# Altium schematic sheet Bypass_FPGA_3V3.SchDoc: FPGA Bypass 3V3
size A4; Organization: Altium Limited.; Address1: Level 3, 12a Rodborough Rd; Address2: Frenchs Forest 2086; Address3: NSW; Address4: AUSTRALIA; SheetNumber: 7; SheetTotal: 23; PageSetup: Record=PageOptions|CenterHorizontal=True|CenterVertical=True|PrintScale=0.97|XCorrection=1.00|YCorrection=1.00|PrintKind=0|BorderSize=5000000|LeftOffset=0|BottomOffset=0|Orientation=2|PaperLength=1000|PaperWidth=1000|Scale=100|PaperSource=7|PrintQuality=-4|MediaType=1|DitherType=10|PaperKind=A4 (210 x 297 mm)|PrintScaleMode=1
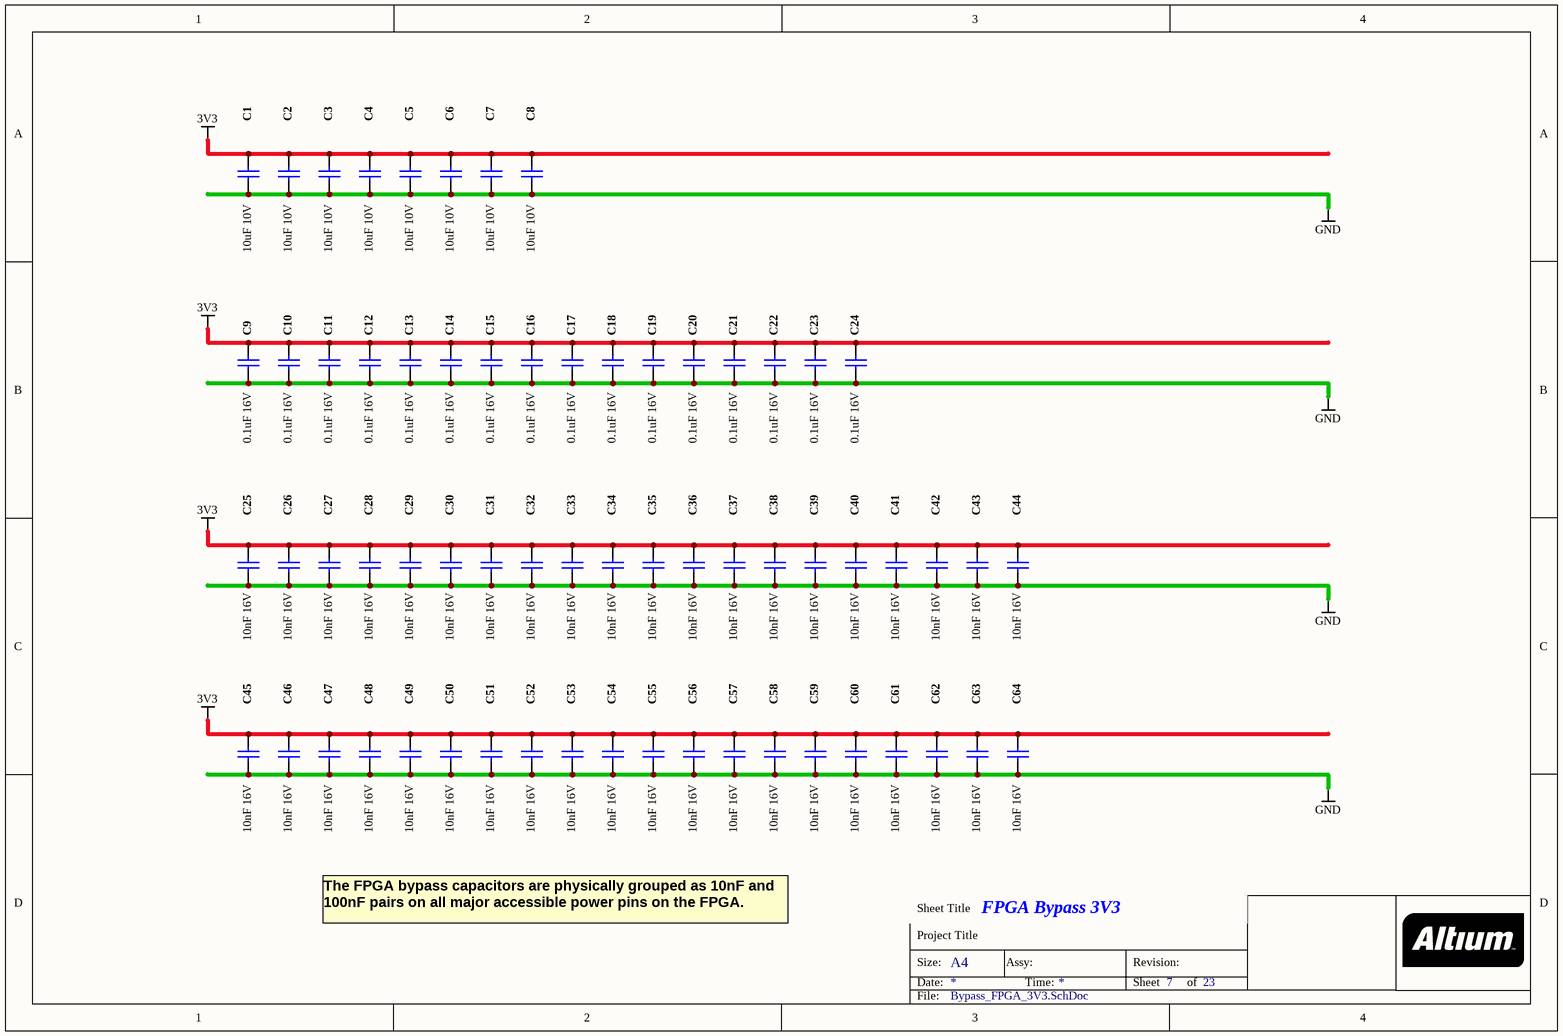
[diagram p0: Bypass_FPGA_3V3.SchDoc]

## Parts
C1  10uF 10V  [CAPC2012-STAR]
C2  10uF 10V  [CAPC2012-STAR]
C3  10uF 10V  [CAPC2012-STAR]
C4  10uF 10V  [CAPC2012-STAR]
C5  10uF 10V  [CAPC2012-STAR]
C6  10uF 10V  [CAPC2012-STAR]
C7  10uF 10V  [CAPC2012-STAR]
C8  10uF 10V  [CAPC2012-STAR]
C9  0.1uF 16V  [CAPC1005-STAR]
C10  0.1uF 16V  [CAPC1005-STAR]
C11  0.1uF 16V  [CAPC1005-STAR]
C12  0.1uF 16V  [CAPC1005-STAR]
C13  0.1uF 16V  [CAPC1005-STAR]
C14  0.1uF 16V  [CAPC1005-STAR]
C15  0.1uF 16V  [CAPC1005-STAR]
C16  0.1uF 16V  [CAPC1005-STAR]
C17  0.1uF 16V  [CAPC1005-STAR]
C18  0.1uF 16V  [CAPC1005-STAR]
C19  0.1uF 16V  [CAPC1005-STAR]
C20  0.1uF 16V  [CAPC1005-STAR]
C21  0.1uF 16V  [CAPC1005-STAR]
C22  0.1uF 16V  [CAPC1005-STAR]
C23  0.1uF 16V  [CAPC1005-STAR]
C24  0.1uF 16V  [CAPC1005-STAR]
C25  10nF 16V  [CAPC1005-STAR]
C26  10nF 16V  [CAPC1005-STAR]
C27  10nF 16V  [CAPC1005-STAR]
C28  10nF 16V  [CAPC1005-STAR]
C29  10nF 16V  [CAPC1005-STAR]
C30  10nF 16V  [CAPC1005-STAR]
C31  10nF 16V  [CAPC1005-STAR]
C32  10nF 16V  [CAPC1005-STAR]
C33  10nF 16V  [CAPC1005-STAR]
C34  10nF 16V  [CAPC1005-STAR]
C35  10nF 16V  [CAPC1005-STAR]
C36  10nF 16V  [CAPC1005-STAR]
C37  10nF 16V  [CAPC1005-STAR]
C38  10nF 16V  [CAPC1005-STAR]
C39  10nF 16V  [CAPC1005-STAR]
C40  10nF 16V  [CAPC1005-STAR]
C41  10nF 16V  [CAPC1005-STAR]
C42  10nF 16V  [CAPC1005-STAR]
C43  10nF 16V  [CAPC1005-STAR]
C44  10nF 16V  [CAPC1005-STAR]
C45  10nF 16V  [CAPC1005-STAR]
C46  10nF 16V  [CAPC1005-STAR]
C47  10nF 16V  [CAPC1005-STAR]
C48  10nF 16V  [CAPC1005-STAR]
C49  10nF 16V  [CAPC1005-STAR]
C50  10nF 16V  [CAPC1005-STAR]
C51  10nF 16V  [CAPC1005-STAR]
C52  10nF 16V  [CAPC1005-STAR]
C53  10nF 16V  [CAPC1005-STAR]
C54  10nF 16V  [CAPC1005-STAR]
C55  10nF 16V  [CAPC1005-STAR]
C56  10nF 16V  [CAPC1005-STAR]
C57  10nF 16V  [CAPC1005-STAR]
C58  10nF 16V  [CAPC1005-STAR]
C59  10nF 16V  [CAPC1005-STAR]
C60  10nF 16V  [CAPC1005-STAR]
C61  10nF 16V  [CAPC1005-STAR]
C62  10nF 16V  [CAPC1005-STAR]
C63  10nF 16V  [CAPC1005-STAR]
C64  10nF 16V  [CAPC1005-STAR]

## Nets
3V3: C1.1 C2.1 C3.1 C4.1 C5.1 C6.1 C7.1 C8.1 C9.1 C10.1 C11.1 C12.1 C13.1 C14.1 C15.1 C16.1 C17.1 C18.1 C19.1 C20.1 C21.1 C22.1 C23.1 C24.1 C25.1 C26.1 C27.1 C28.1 C29.1 C30.1 C31.1 C32.1 C33.1 C34.1 C35.1 C36.1 C37.1 C38.1 C39.1 C40.1 C41.1 C42.1 C43.1 C44.1 C45.1 C46.1 C47.1 C48.1 C49.1 C50.1 C51.1 C52.1 C53.1 C54.1 C55.1 C56.1 C57.1 C58.1 C59.1 C60.1 C61.1 C62.1 C63.1 C64.1
GND: C1.2 C2.2 C3.2 C4.2 C5.2 C6.2 C7.2 C8.2 C9.2 C10.2 C11.2 C12.2 C13.2 C14.2 C15.2 C16.2 C17.2 C18.2 C19.2 C20.2 C21.2 C22.2 C23.2 C24.2 C25.2 C26.2 C27.2 C28.2 C29.2 C30.2 C31.2 C32.2 C33.2 C34.2 C35.2 C36.2 C37.2 C38.2 C39.2 C40.2 C41.2 C42.2 C43.2 C44.2 C45.2 C46.2 C47.2 C48.2 C49.2 C50.2 C51.2 C52.2 C53.2 C54.2 C55.2 C56.2 C57.2 C58.2 C59.2 C60.2 C61.2 C62.2 C63.2 C64.2

## Notes on the sheet
- The FPGA bypass capacitors are physically grouped as 10nF and 100nF pairs on all major accessible power pins on the FPGA.
- Sheet Title
- Project Title
- Size:
- Date:
- A4
- Assy:
- Time:
- Revision:
- Sheet
- of
- File:

## Library data of the parts
C1-C8 = D-101-0087: Capacitor, Ceramic, 10uF 10% 10V 0805 (2012) X5R; Polarity: Non-Polarized; Category: Capacitor; Capacitance: 10 uF; Dielectric: X5R; Mounting Technology: Surface Mount; Rated Voltage: 10 V; Status: Unreleased; Technology: None; Tolerance: 10 %
C9-C24 = D-101-0080: Capacitor, Ceramic, 0.1uF 10% 16V 0402 (1005) X7R; Polarity: Non-Polarized; Category: Capacitor; Capacitance: 0.1 uF; Dielectric: X7R; Mounting Technology: Surface Mount; Rated Voltage: 16 V; Status: Production; Technology: Ceramic; Tolerance: 10 %
C25-C64 = D-101-0077: Capacitor, Ceramic, 10nF 10% 16V 0402 (1005) X7R; Polarity: Non-Polarized; Category: Capacitor; Capacitance: 10 nF; Dielectric: X7R; Mounting Technology: Surface Mount; Rated Voltage: 16 V; Status: Production; Technology: Ceramic; Tolerance: 10 %